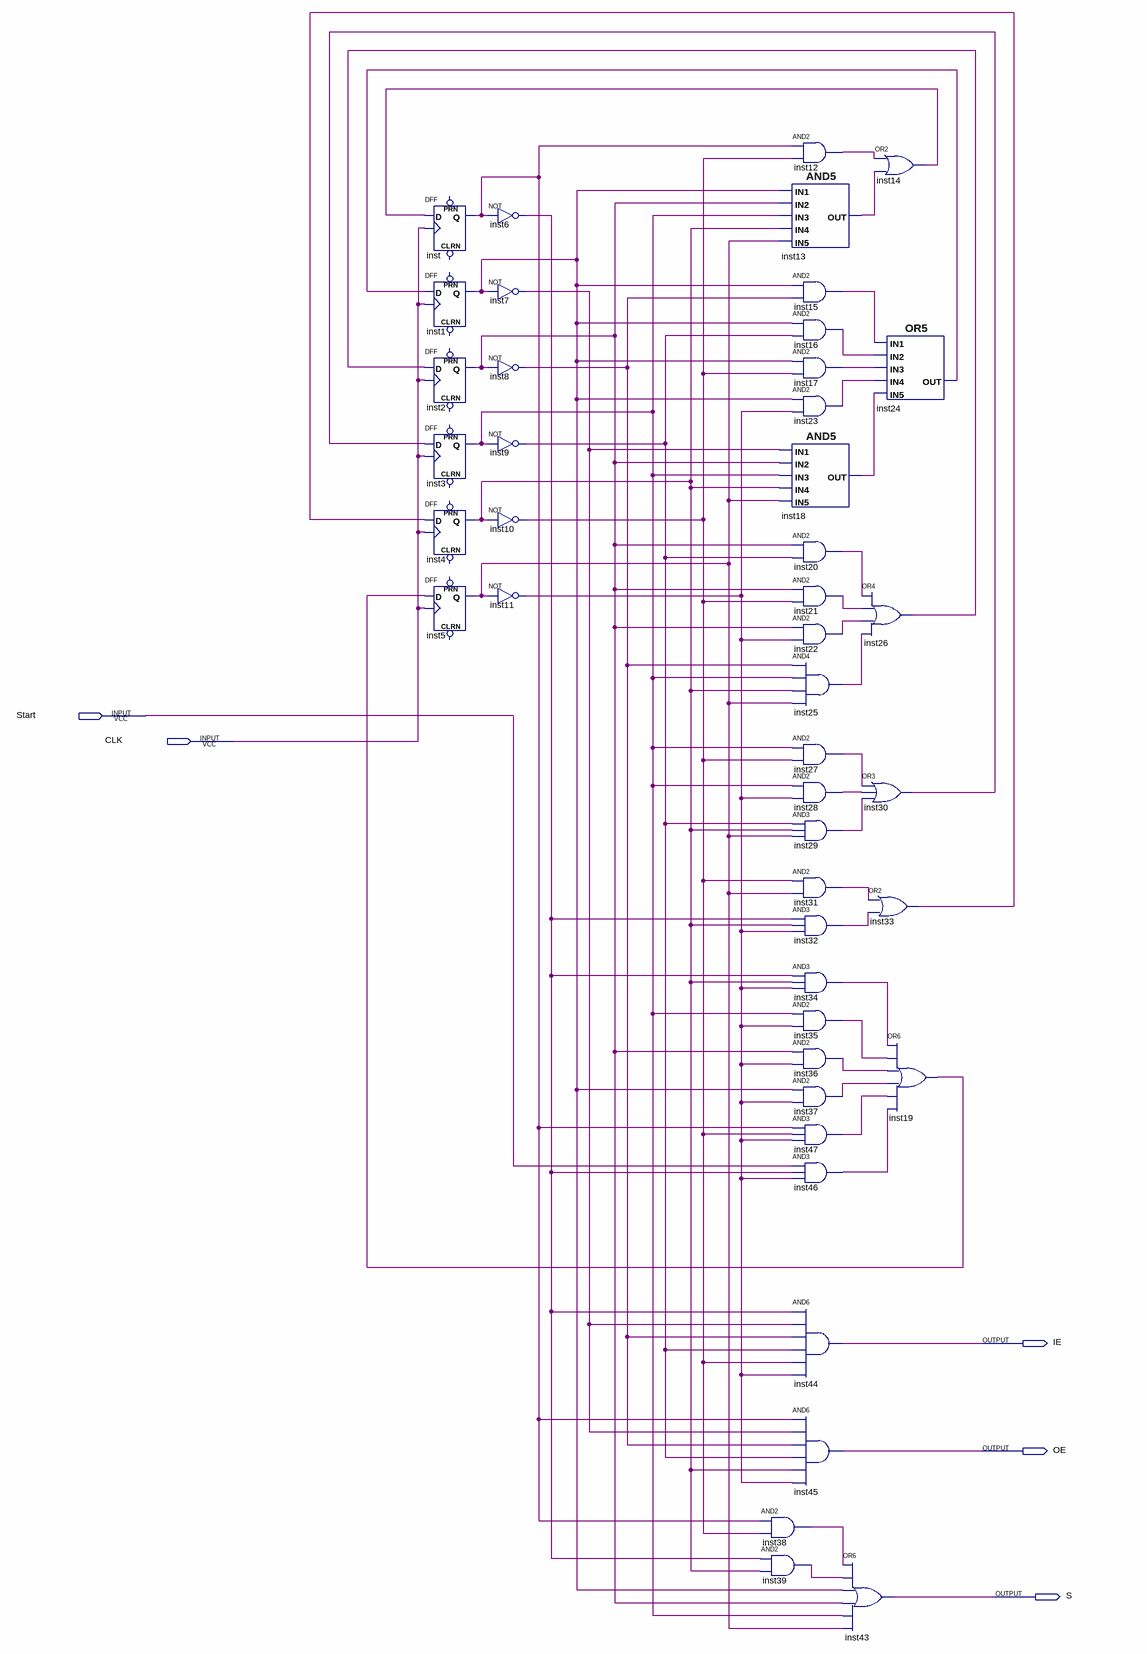
[diagram p0: schematic sheet]
// Quartus schematic controller.bdf as structural Verilog: 45 symbols, 5 pins
module controller (
  input  Start,
  input  CLK,
  output IE,
  output OE,
  output S
);

  wire inst1_q, inst2_q, inst3_q, inst4_q, inst5_q, inst6_out, inst7_out, inst8_out, inst9_out, inst10_out,
       inst11_out, inst12_out, inst13_out, inst14_out, inst15_out, inst16_out, inst17_out, inst18_out,
       inst19_out, inst20_out, inst21_out, inst22_out, inst23_out, inst24_out, inst25_out, inst26_out,
       inst27_out, inst28_out, inst29_out, inst30_out, inst31_out, inst32_out, inst33_out, inst34_out,
       inst35_out, inst36_out, inst37_out, inst38_out, inst39_out, inst46_out, inst47_out, inst_q;

  DFF inst (.CLK(CLK), .D(inst14_out), .Q(inst_q));  // open: CLRN, PRN
  DFF inst1 (.CLK(CLK), .D(inst24_out), .Q(inst1_q));  // open: CLRN, PRN
  DFF inst2 (.CLK(CLK), .D(inst26_out), .Q(inst2_q));  // open: CLRN, PRN
  DFF inst3 (.CLK(CLK), .D(inst30_out), .Q(inst3_q));  // open: CLRN, PRN
  DFF inst4 (.CLK(CLK), .D(inst33_out), .Q(inst4_q));  // open: CLRN, PRN
  DFF inst5 (.CLK(CLK), .D(inst19_out), .Q(inst5_q));  // open: CLRN, PRN
  not inst6 (inst6_out, inst_q);
  not inst7 (inst7_out, inst1_q);
  not inst8 (inst8_out, inst2_q);
  not inst9 (inst9_out, inst3_q);
  not inst10 (inst10_out, inst4_q);
  not inst11 (inst11_out, inst5_q);
  and inst13 (inst13_out, inst1_q, inst2_q, inst3_q, inst4_q, inst5_q);
  and inst18 (inst18_out, inst7_out, inst2_q, inst3_q, inst4_q, inst5_q);
  and inst38 (inst38_out, inst_q, inst10_out);
  and inst39 (inst39_out, inst6_out, inst4_q);
  and inst12 (inst12_out, inst_q, inst10_out);
  and inst15 (inst15_out, inst1_q, inst8_out);
  and inst16 (inst16_out, inst1_q, inst9_out);
  and inst17 (inst17_out, inst1_q, inst10_out);
  and inst23 (inst23_out, inst1_q, inst11_out);
  and inst20 (inst20_out, inst2_q, inst9_out);
  and inst21 (inst21_out, inst2_q, inst10_out);
  and inst22 (inst22_out, inst2_q, inst11_out);
  and inst25 (inst25_out, inst8_out, inst3_q, inst4_q, inst5_q);
  and inst27 (inst27_out, inst3_q, inst10_out);
  and inst28 (inst28_out, inst3_q, inst11_out);
  and inst29 (inst29_out, inst9_out, inst4_q, inst5_q);
  and inst31 (inst31_out, inst10_out, inst5_q);
  and inst32 (inst32_out, inst6_out, inst4_q, inst11_out);
  and inst34 (inst34_out, inst6_out, inst4_q, inst11_out);
  and inst35 (inst35_out, inst3_q, inst11_out);
  and inst36 (inst36_out, inst2_q, inst11_out);
  and inst37 (inst37_out, inst1_q, inst11_out);
  and inst47 (inst47_out, inst_q, inst10_out, inst11_out);
  and inst46 (inst46_out, Start, inst6_out, inst11_out);
  and inst44 (IE, inst6_out, inst7_out, inst8_out, inst9_out, inst10_out, inst11_out);
  and inst45 (OE, inst_q, inst7_out, inst8_out, inst9_out, inst4_q, inst11_out);
  or inst14 (inst14_out, inst12_out, inst13_out);
  or inst24 (inst24_out, inst15_out, inst16_out, inst17_out, inst23_out, inst18_out);
  or inst26 (inst26_out, inst20_out, inst21_out, inst22_out, inst25_out);
  or inst30 (inst30_out, inst27_out, inst28_out, inst29_out);
  or inst33 (inst33_out, inst31_out, inst32_out);
  or inst19 (inst19_out, inst34_out, inst35_out, inst36_out, inst37_out, inst47_out, inst46_out);
  or inst43 (S, inst38_out, inst39_out, inst1_q, inst2_q, inst3_q, inst5_q);
endmodule
